# EAGLE design schematic1 (EAGLE 7.1.0)
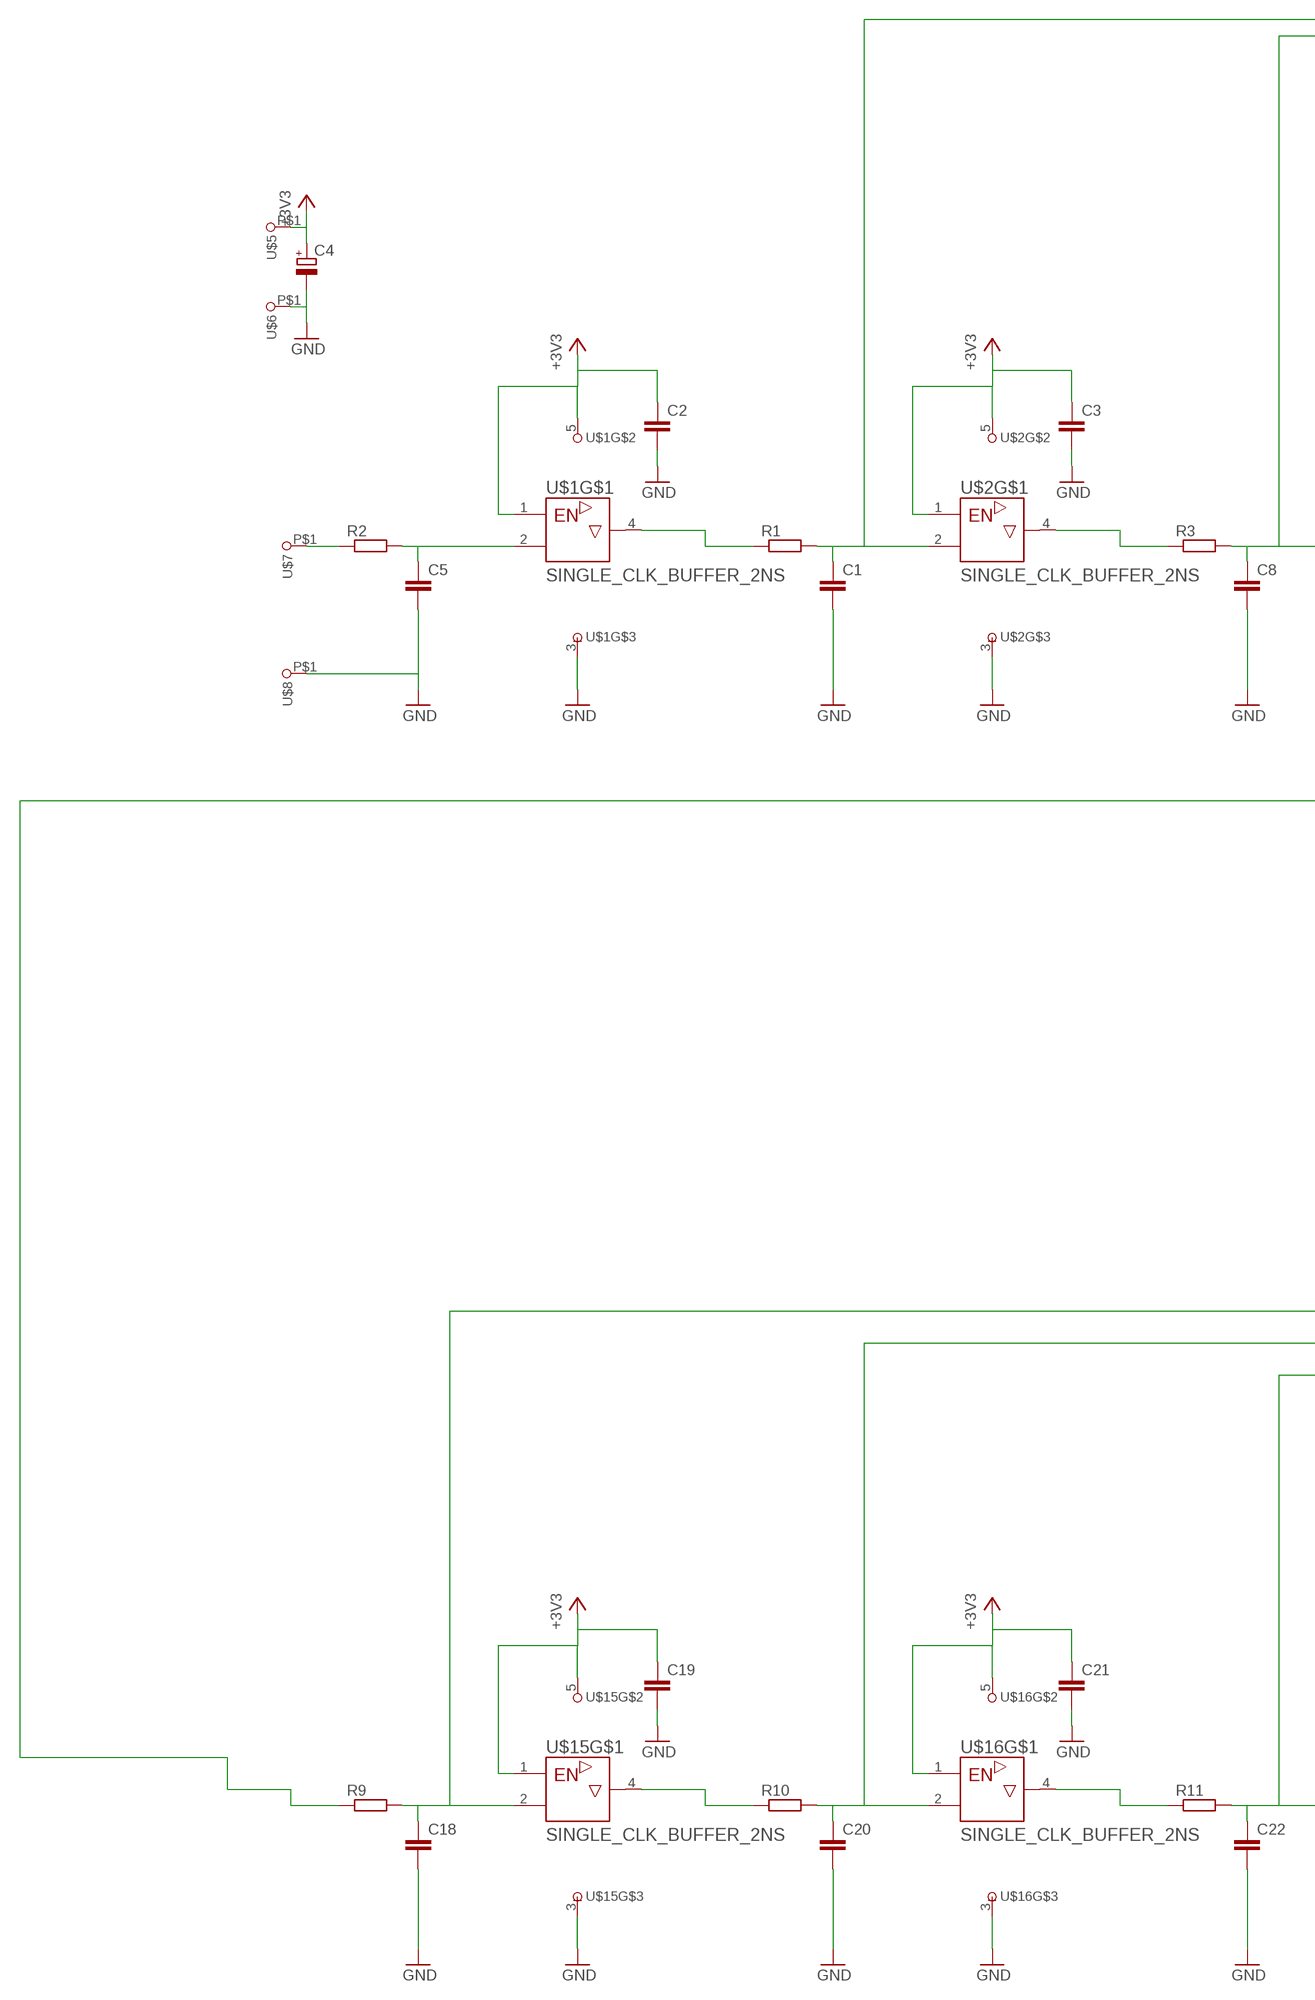
[diagram p0: schematic, sheet 1, part 1 of 2]
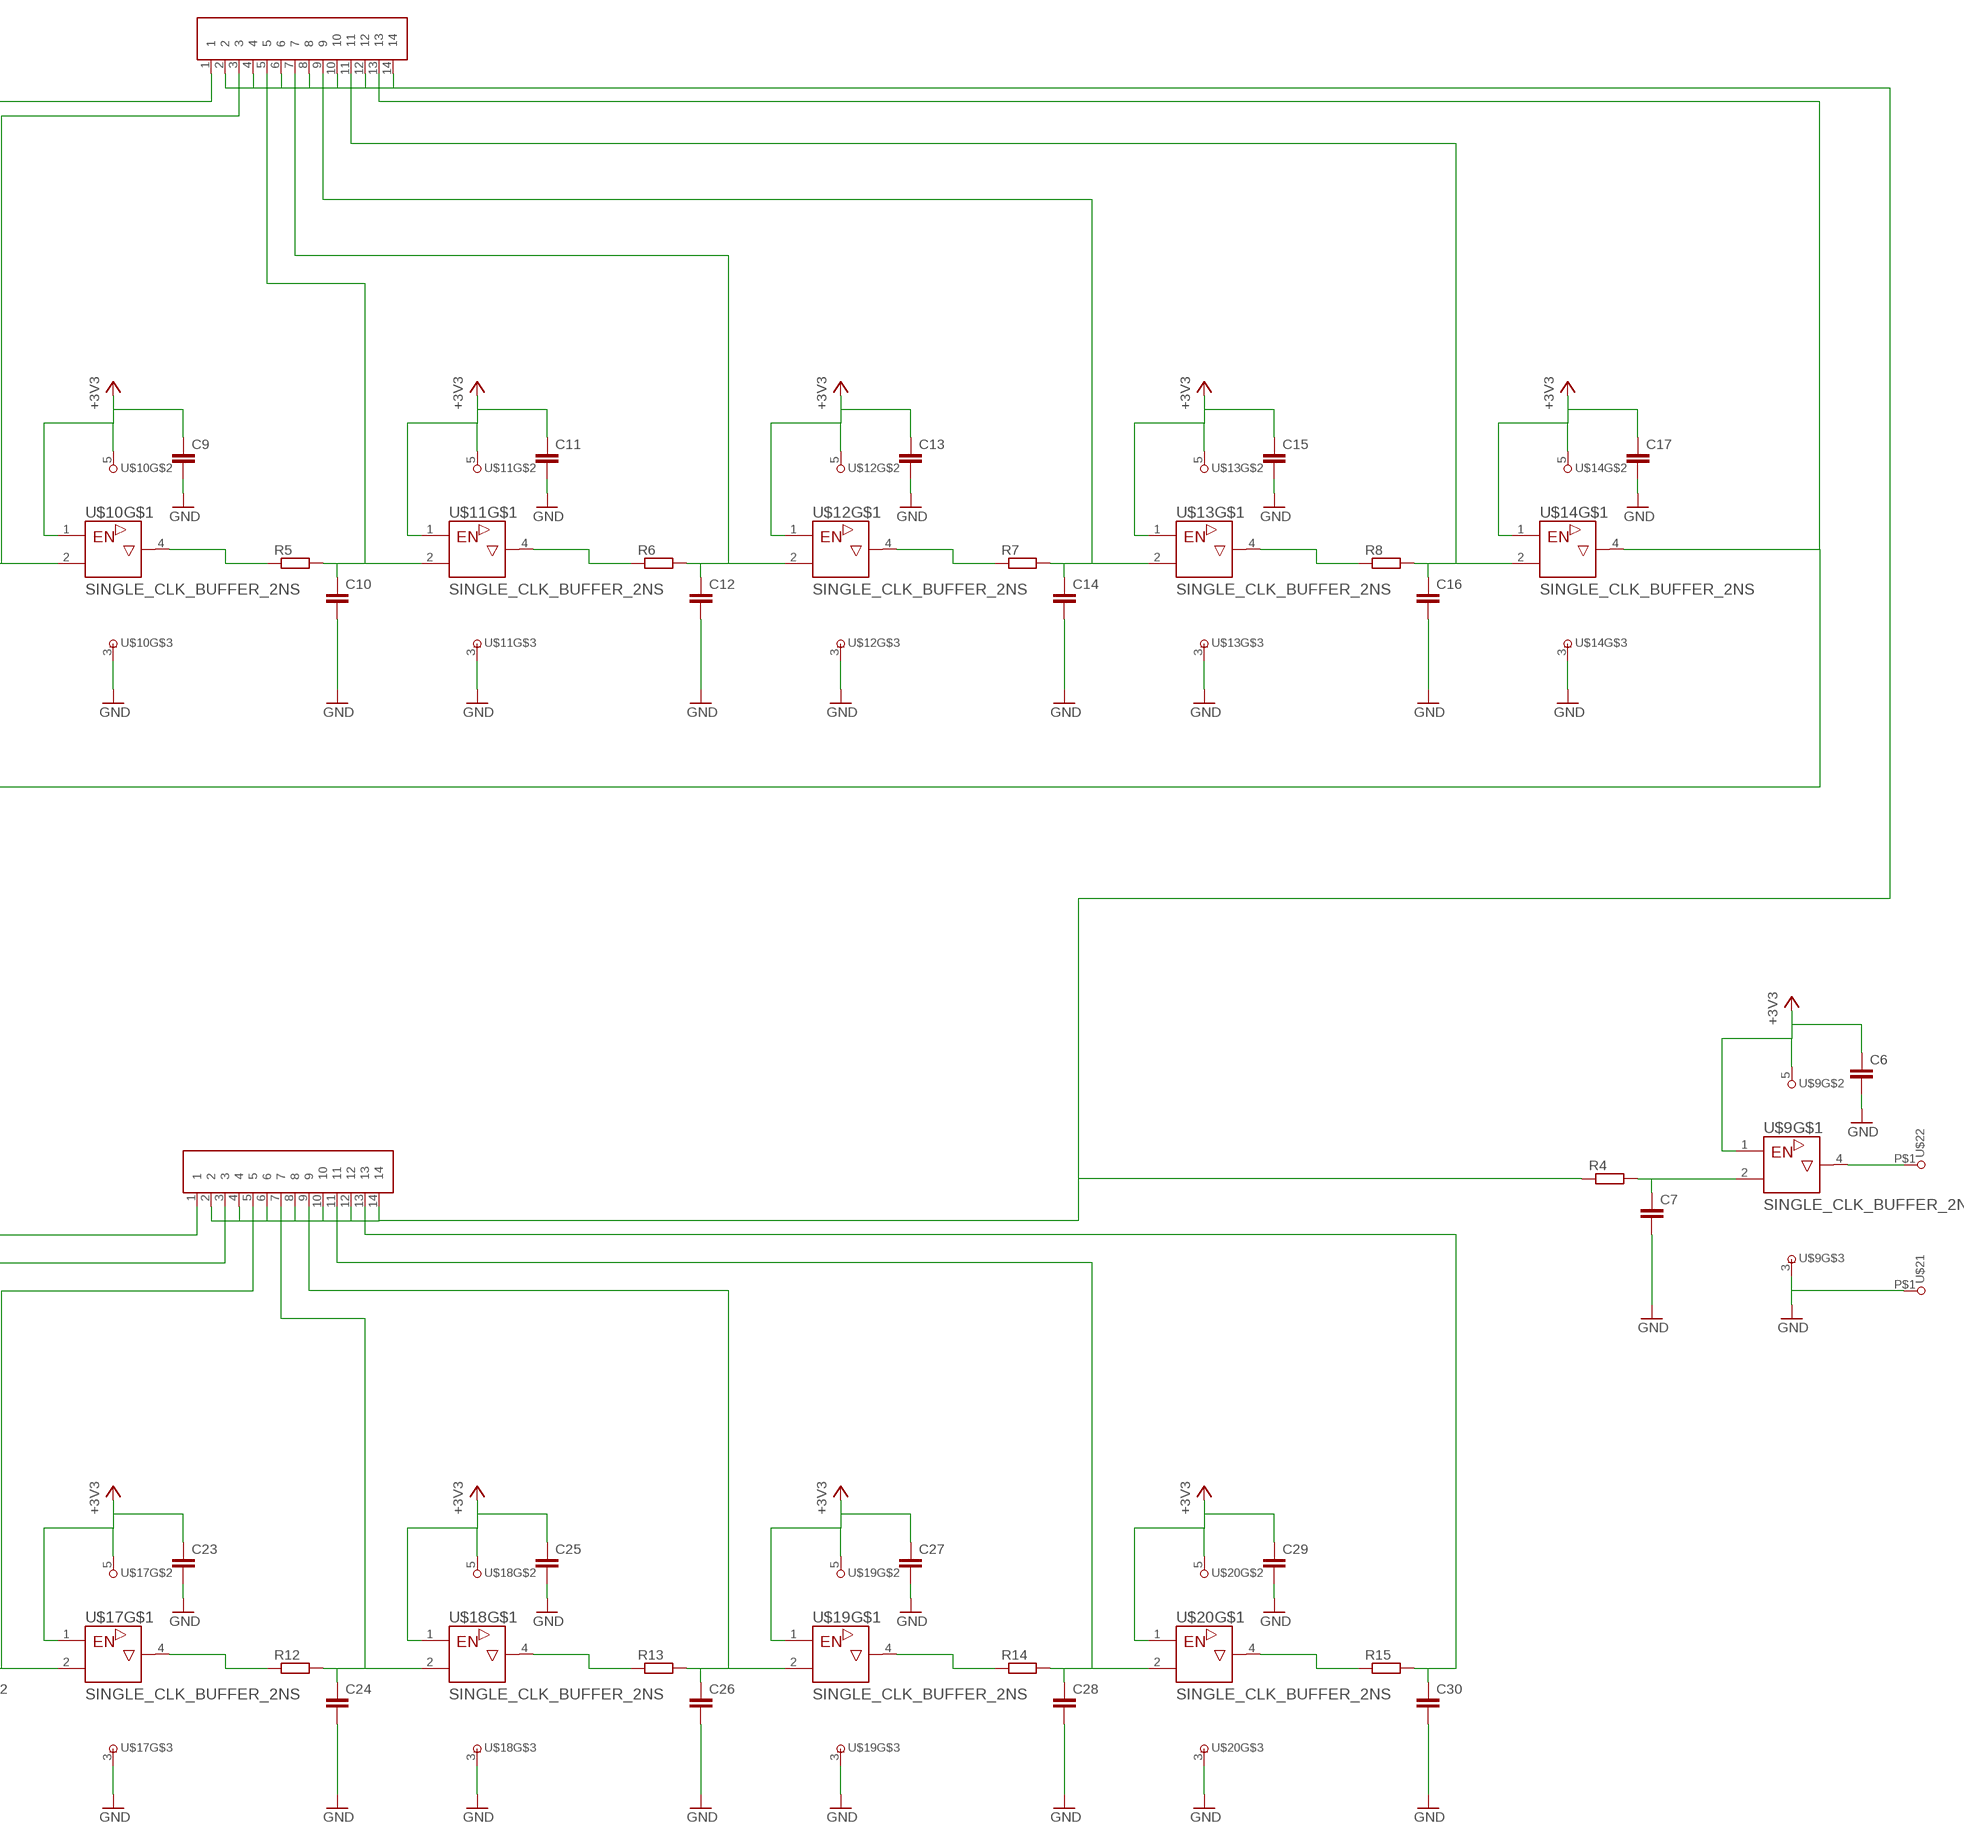
[diagram p1: schematic, sheet 1, part 2 of 2]

## Parts
C1  C-EUC0603  [C0603]
C2  C-EUC0805  [C0805]
C3  C-EUC0805  [C0805]
C4  CPOL-EUSMCD  [SMC_D]
C5  C-EUC0603  [C0603]
C6  C-EUC0805  [C0805]
C7  C-EUC0603  [C0603]
C8  C-EUC0603  [C0603]
C9  C-EUC0805  [C0805]
C10  C-EUC0603  [C0603]
C11  C-EUC0805  [C0805]
C12  C-EUC0603  [C0603]
C13  C-EUC0805  [C0805]
C14  C-EUC0603  [C0603]
C15  C-EUC0805  [C0805]
C16  C-EUC0603  [C0603]
C17  C-EUC0805  [C0805]
C18  C-EUC0603  [C0603]
C19  C-EUC0805  [C0805]
C20  C-EUC0603  [C0603]
C21  C-EUC0805  [C0805]
C22  C-EUC0603  [C0603]
C23  C-EUC0805  [C0805]
C24  C-EUC0603  [C0603]
C25  C-EUC0805  [C0805]
C26  C-EUC0603  [C0603]
C27  C-EUC0805  [C0805]
C28  C-EUC0603  [C0603]
C29  C-EUC0805  [C0805]
C30  C-EUC0603  [C0603]
R1  R-EU_R0603  [R0603]
R2  R-EU_R0603  [R0603]
R3  R-EU_R0603  [R0603]
R4  R-EU_R0603  [R0603]
R5  R-EU_R0603  [R0603]
R6  R-EU_R0603  [R0603]
R7  R-EU_R0603  [R0603]
R8  R-EU_R0603  [R0603]
R9  R-EU_R0603  [R0603]
R10  R-EU_R0603  [R0603]
R11  R-EU_R0603  [R0603]
R12  R-EU_R0603  [R0603]
R13  R-EU_R0603  [R0603]
R14  R-EU_R0603  [R0603]
R15  R-EU_R0603  [R0603]
U$1  SINGLE_CLK_BUFFER_2NS  [DCK]
U$2  SINGLE_CLK_BUFFER_2NS  [DCK]
U$3  2X7SMD_HEADER  [2X14SMDPADS]
U$4  2X7SMD_HEADER  [2X14SMDPADS]
U$5  BIGGOPAD  [BIGGOPAD]
U$6  BIGGOPAD  [BIGGOPAD]
U$7  BIGGOPAD  [BIGGOPAD]
U$8  BIGGOPAD  [BIGGOPAD]
U$9  SINGLE_CLK_BUFFER_2NS  [DCK]
U$10  SINGLE_CLK_BUFFER_2NS  [DCK]
U$11  SINGLE_CLK_BUFFER_2NS  [DCK]
U$12  SINGLE_CLK_BUFFER_2NS  [DCK]
U$13  SINGLE_CLK_BUFFER_2NS  [DCK]
U$14  SINGLE_CLK_BUFFER_2NS  [DCK]
U$15  SINGLE_CLK_BUFFER_2NS  [DCK]
U$16  SINGLE_CLK_BUFFER_2NS  [DCK]
U$17  SINGLE_CLK_BUFFER_2NS  [DCK]
U$18  SINGLE_CLK_BUFFER_2NS  [DCK]
U$19  SINGLE_CLK_BUFFER_2NS  [DCK]
U$20  SINGLE_CLK_BUFFER_2NS  [DCK]
U$21  BIGGOPAD  [BIGGOPAD]
U$22  BIGGOPAD  [BIGGOPAD]

## Nets
+3V3: C2.1 C3.1 C4.+ C6.1 C9.1 C11.1 C13.1 C15.1 C17.1 C19.1 C21.1 C23.1 C25.1 C27.1 C29.1 U$1.1(G) U$1.5(+UB) U$2.1(G) U$2.5(+UB) U$5.P$1(+UB) U$9.1(G) U$9.5(+UB) U$10.1(G) U$10.5(+UB) U$11.1(G) U$11.5(+UB) U$12.1(G) U$12.5(+UB) U$13.1(G) U$13.5(+UB) U$14.1(G) U$14.5(+UB) U$15.1(G) U$15.5(+UB) U$16.1(G) U$16.5(+UB) U$17.1(G) U$17.5(+UB) U$18.1(G) U$18.5(+UB) U$19.1(G) U$19.5(+UB) U$20.1(G) U$20.5(+UB)
GND [Ground]: C1.2 C2.2 C3.2 C4.- C5.2 C6.2 C7.2 C8.2 C9.2 C10.2 C11.2 C12.2 C13.2 C14.2 C15.2 C16.2 C17.2 C18.2 C19.2 C20.2 C21.2 C22.2 C23.2 C24.2 C25.2 C26.2 C27.2 C28.2 C29.2 C30.2 U$1.3(-UB) U$2.3(-UB) U$6.P$1(+UB) U$8.P$1(+UB) U$9.3(-UB) U$10.3(-UB) U$11.3(-UB) U$12.3(-UB) U$13.3(-UB) U$14.3(-UB) U$15.3(-UB) U$16.3(-UB) U$17.3(-UB) U$18.3(-UB) U$19.3(-UB) U$20.3(-UB) U$21.P$1(+UB)
N$1: C5.1 R2.2 U$1.2(A)
N$2: R2.1 U$7.P$1(+UB)
N$3: C1.1 R1.2 U$2.2(A) U$3.1
N$4: R1.1 U$1.4(Y)
N$5: C7.1 R4.2 U$9.2(A)
N$6: R3.1 U$2.4(Y)
N$7: C8.1 R3.2 U$3.3 U$10.2(A)
N$9: C10.1 R5.2 U$3.5 U$11.2(A)
N$10: R5.1 U$10.4(Y)
N$11: C12.1 R6.2 U$3.7 U$12.2(A)
N$12: R6.1 U$11.4(Y)
N$13: C14.1 R7.2 U$3.9 U$13.2(A)
N$14: R7.1 U$12.4(Y)
N$15: C16.1 R8.2 U$3.11 U$14.2(A)
N$16: R8.1 U$13.4(Y)
N$17: C18.1 R9.2 U$4.1 U$15.2(A)
N$18: R9.1 U$3.13 U$14.4(Y)
N$19: C20.1 R10.2 U$4.3 U$16.2(A)
N$20: R10.1 U$15.4(Y)
N$21: C22.1 R11.2 U$4.5 U$17.2(A)
N$22: R11.1 U$16.4(Y)
N$23: C24.1 R12.2 U$4.7 U$18.2(A)
N$24: R12.1 U$17.4(Y)
N$25: C26.1 R13.2 U$4.9 U$19.2(A)
N$26: R13.1 U$18.4(Y)
N$27: C28.1 R14.2 U$4.11 U$20.2(A)
N$28: R14.1 U$19.4(Y)
N$29: C30.1 R15.2 U$4.13
N$30: R15.1 U$20.4(Y)
N$31: U$9.4(Y) U$22.P$1(+UB)
OUTPUT [otp]: R4.1 U$3.2 U$3.4 U$3.6 U$3.8 U$3.10 U$3.12 U$3.14 U$4.2 U$4.4 U$4.6 U$4.8 U$4.10 U$4.12 U$4.14

## Library data of the parts
C1-C3 C5-C30 = rcl:C-EU: CAPACITOR, European symbol
C4 = rcl:CPOL-EU: POLARIZED CAPACITOR, European symbol
R1-R15 = rcl:R-EU_: RESISTOR, European symbol
U$1 U$2 U$9-U$20 = misc:SINGLE_CLK_BUFFER_2NS
U$3 U$4 = synth_design:2X7SMD_HEADER
U$5-U$8 U$21 U$22 = misc:BIGGOPAD

## Net classes
1 Ground: clearance 0.305 mm
2 otp: clearance 0.305 mm

## Board
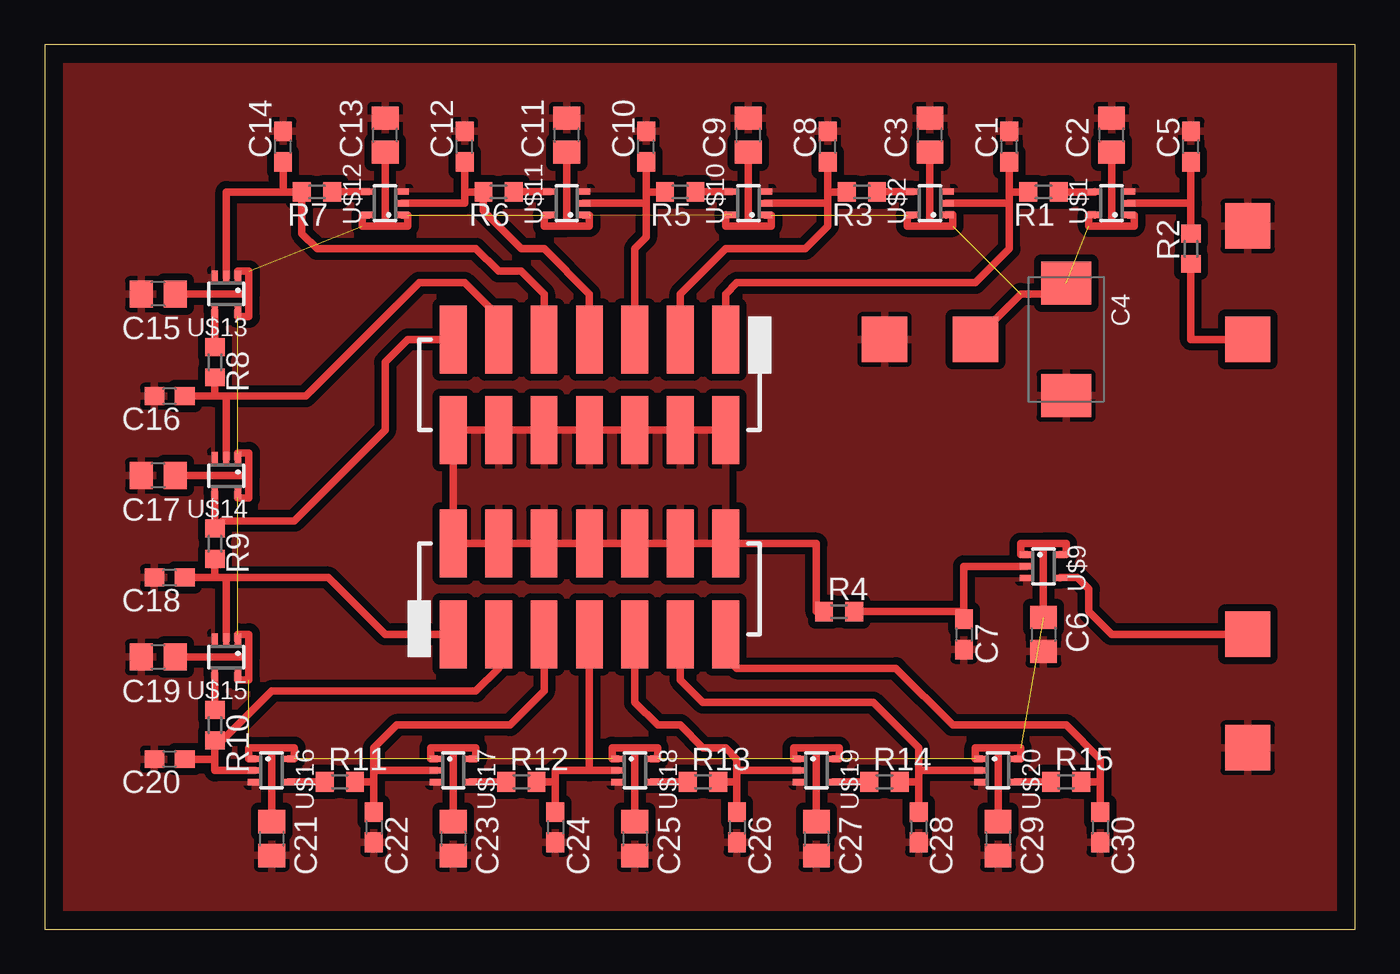
[diagram p2: board, top side]

Size 73.33 x 49.52 mm. Coordinates in mm from the lower left corner, seen from the top.
Outline: 0,0 73.33,0 73.33,49.52 0,49.52 0,0
Copper layers (1*16): Top 0.035mm / dielectric 1.5mm / Bottom 0.035mm
Design rules "default *": minimum track width 10mil, minimum drill 24mil, track to track 16mil, track to pad 12mil, pad to pad 16mil, via to via 16mil, smd to smd 8mil, copper to edge 40mil, drill to drill 8mil, minimum pad ring 10mil, minimum via ring 8mil, stop-mask expansion 4mil, vias tented up to drill 0mil, thermal gap 10mil

### Footprints (pad centres in the part's own frame; a part is rotated, then mirrored left to right if it is on the bottom)
C0603 = smd 1.1 x 1: 1 -0.85,0; 2 0.85,0
C0805 = smd 1.3 x 1.5: 1 -0.95,0; 2 0.95,0
SMC_D = smd 2.4 x 2.8: + -3.15,0; - 3.15,0
R0603 = smd 1 x 1.1: 1 -0.85,0; 2 0.85,0
DCK = smd 0.35 x 0.8: 1 -0.65,-0.925; 2 0,-0.925; 3 0.65,-0.925; 4 0.65,0.925; 5 -0.65,0.925
2X14SMDPADS = smd 3.81 x 1.499: 1 -2.54,7.62; 2 2.54,7.62; 3 -2.54,5.08; 4 2.54,5.08; 5 -2.54,2.54; 6 2.54,2.54; 7 -2.54,0; 8 2.54,0; 9 -2.54,-2.54; 10 2.54,-2.54; 11 -2.54,-5.08; 12 2.54,-5.08; 13 -2.54,-7.62; 14 2.54,-7.62
BIGGOPAD = smd 2.54 x 2.54: P$1 0,0

### Placement (x,y rotation side)
C1  53.98,43.81 90 top
C2  59.69,44.45 90 top
C3  49.53,44.45 90 top
C4  57.15,33.02 270 top
C5  64.14,43.81 90 top
C6  55.88,16.51 270 top
C7  51.44,16.51 270 top
C8  43.81,43.81 90 top
C9  39.37,44.45 90 top
C10  33.66,43.81 90 top
C11  29.21,44.45 90 top
C12  23.5,43.81 90 top
C13  19.05,44.45 90 top
C14  13.34,43.81 90 top
C15  6.35,35.56 180 top
C16  6.99,29.84 180 top
C17  6.35,25.4 180 top
C18  6.99,19.68 180 top
C19  6.35,15.24 180 top
C20  6.99,9.53 180 top
C21  12.7,5.08 270 top
C22  18.41,5.71 270 top
C23  22.86,5.08 270 top
C24  28.57,5.71 270 top
C25  33.02,5.08 270 top
C26  38.73,5.71 270 top
C27  43.18,5.08 270 top
C28  48.9,5.71 270 top
C29  53.34,5.08 270 top
C30  59.05,5.71 270 top
R1  55.88,41.27 180 top
R2  64.14,38.1 90 top
R3  45.72,41.27 180 top
R4  44.45,17.78 0 top
R5  35.56,41.27 180 top
R6  25.4,41.27 180 top
R7  15.24,41.27 180 top
R8  9.53,31.75 270 top
R9  9.53,21.59 270 top
R10  9.53,11.43 270 top
R11  16.51,8.26 0 top
R12  26.67,8.26 0 top
R13  36.83,8.26 0 top
R14  46.99,8.26 0 top
R15  57.15,8.26 0 top
U$1  59.69,40.64 90 top
U$2  49.53,40.64 90 top
U$3  30.48,30.48 270 top
U$4  30.48,19.05 90 top
U$5  52.07,33.02 180 top
U$6  67.31,39.37 180 top
U$7  67.31,33.02 180 top
U$8  46.99,33.02 180 top
U$9  55.88,20.32 270 top
U$10  39.37,40.64 90 top
U$11  29.21,40.64 90 top
U$12  19.05,40.64 90 top
U$13  10.16,35.56 180 top
U$14  10.16,25.4 180 top
U$15  10.16,15.24 180 top
U$16  12.7,8.89 270 top
U$17  22.86,8.89 270 top
U$18  33.02,8.89 270 top
U$19  43.18,8.89 270 top
U$20  53.34,8.89 270 top
U$21  67.31,10.16 0 top
U$22  67.31,16.51 0 top

### Tracks (layer width: path | path; a pad name or v marks a point on that pad's centre or on a via)
+3V3  (15 unrouted)
  Top 0.406: U$1.1 60.96,39.99 60.96,39.37 59.69,39.37 | 59.69,39.37 58.42,39.37 58.42,40.01 58.77,40.01 U$1.5 | C2.1 59.69,39.37 | U$2.5 48.26,39.99 48.26,39.37 49.53,39.37 | 49.53,39.37 50.8,39.37 50.8,40.01 50.45,40.01 U$2.1 | C3.1 49.53,39.37 | U$10.1 40.64,39.99 40.64,39.37 39.37,39.37 | 38.1,40.01 38.1,39.37 39.37,39.37 | U$11.1 30.48,39.99 30.48,39.37 29.21,39.37 | 29.21,39.37 C11.1 | U$11.5 27.94,39.99 27.94,39.37 29.21,39.37 | U$12.1 20.32,39.99 20.32,39.37 19.05,39.37 | 19.05,39.37 C13.1 | U$12.5 17.78,39.99 17.78,39.37 19.05,39.37 | U$13.1 10.81,36.83 11.43,36.83 11.43,35.56 | 11.43,35.56 C15.1 | U$13.5 10.81,34.29 11.43,34.29 11.43,35.56 | U$14.1 10.81,26.67 11.43,26.67 11.43,25.4 | 11.43,25.4 C17.1 | U$14.5 10.81,24.13 11.43,24.13 11.43,25.4 | C9.1 39.37,39.37 | U$15.5 10.81,13.97 11.43,13.97 11.43,15.24 | 11.43,15.24 C19.1 | U$15.1 10.81,16.51 11.43,16.51 11.43,15.24 | U$16.1 11.43,9.54 11.43,10.16 12.7,10.16 | 12.7,10.16 C21.1 | U$16.5 13.97,9.54 13.97,10.16 12.7,10.16 | U$17.1 21.59,9.54 21.59,10.16 22.86,10.16 | 22.86,10.16 C23.1 | U$17.5 24.13,9.54 24.13,10.16 22.86,10.16 | U$18.1 31.75,9.54 31.75,10.16 33.02,10.16 | 33.02,10.16 C25.1 | U$18.5 34.29,9.54 34.29,10.16 33.02,10.16 | U$19.1 41.91,9.54 41.91,10.16 43.18,10.16 | 43.18,10.16 C27.1 | U$19.5 44.45,9.54 44.45,10.16 43.18,10.16 | U$20.1 52.07,9.54 52.07,10.16 53.34,10.16 | 53.34,10.16 C29.1 | U$20.5 54.61,9.54 54.61,10.16 53.34,10.16 | U$9.5 57.15,20.97 57.15,21.59 55.88,21.59 | 55.88,21.59 C6.1 | U$9.1 54.61,20.97 54.61,21.59 55.88,21.59 | U$5.P$1 54.61,35.56 56.54,35.56 C4.+
GND
  pour Top (rank 4): 0,49.53 73.66,49.53 73.66,0 0,0
N$1
  Top 0.406: R2.2 64.14,40.64 | 64.14,40.64 C5.1 | U$1.2 64.14,40.64
N$2
  Top 0.406: U$7.P$1 64.14,33.02 R2.1
N$3
  Top 0.406: R1.2 53.98,41.27 | 53.98,41.27 C1.1 | U$2.2 53.98,40.64 | 53.98,40.64 53.98,41.27 | U$3.1 38.1,35.56 38.73,36.2 52.07,36.2 53.98,38.1 53.98,40.64
N$4
  Top 0.406: R1.1 58.77,41.27 U$1.4
N$5
  Top 0.406: U$9.2 51.44,20.32 C7.1 51.44,17.78 R4.2
N$6
  Top 0.406: U$2.4 46.57,41.29 R3.1
N$7
  Top 0.406: R3.2 43.81,41.27 | 43.81,41.27 C8.1 | U$10.2 43.81,40.64 | 43.81,40.64 43.81,41.27 | U$3.3 35.56,35.56 38.1,38.1 42.55,38.1 43.81,39.37 43.81,40.64
N$9
  Top 0.406: R5.2 33.66,41.27 | 33.66,41.27 C10.1 | U$11.2 33.66,40.64 | 33.66,40.64 33.66,41.27 | 33.66,40.64 33.66,38.73 33.02,38.1 U$3.5
N$10
  Top 0.406: U$10.4 36.41,41.29 R5.1
N$11
  Top 0.406: 23.5,41.27 R6.2 24.55,40.22 26.67,38.1 27.94,38.1 30.48,35.56 U$3.7 | 23.5,41.27 C12.1 | U$12.2 23.5,40.64 23.5,41.27
N$12
  Top 0.406: U$11.4 26.25,41.29 R6.1
N$13
  Top 0.406: 13.34,41.27 R7.2 14.39,38.95 15.24,38.1 24.13,38.1 25.4,36.83 26.67,36.83 27.94,35.56 U$3.9 | 13.34,41.27 C14.1 | U$13.2 10.16,41.27 13.34,41.27
N$14
  Top 0.406: U$12.4 16.09,41.29 R7.1
N$15
  Top 0.406: R8.2 9.53,29.84 | 9.53,29.84 C16.1 | U$14.2 10.16,29.84 | 10.16,29.84 9.53,29.84 | 10.16,29.84 14.61,29.84 20.95,36.2 23.5,36.2 25.4,34.29 U$3.11
N$16
  Top 0.406: U$13.4 9.51,32.6 R8.1
N$17
  Top 0.406: R9.2 9.53,19.68 | 9.53,19.68 C18.1 | U$15.2 10.16,19.68 | 10.16,19.68 9.53,19.68 | U$4.1 19.05,16.51 15.88,19.68 10.16,19.68
N$18
  Top 0.406: U$14.4 9.51,22.44 R9.1 9.95,22.86 13.97,22.86 19.05,27.94 19.05,31.75 20.32,33.02 U$3.13
N$19
  Top 0.406: 9.53,9.53 R10.2 9.95,10.58 12.7,13.34 24.13,13.34 25.4,14.61 U$4.3 | 9.53,9.53 C20.1 | U$16.2 9.53,8.89 9.53,9.53
N$20
  Top 0.406: U$15.4 9.51,12.28 R10.1
N$21
  Top 0.406: R11.2 18.41,8.26 | 18.41,8.26 C22.1 | U$17.2 18.41,8.89 | 18.41,8.89 18.41,8.26 | U$4.5 27.94,13.34 26.04,11.43 19.68,11.43 18.41,10.16 18.41,8.89
N$22
  Top 0.406: U$16.4 15.66,8.24 R11.1
N$23
  Top 0.406: R12.2 28.57,8.26 | 28.57,8.26 C24.1 | U$18.2 30.48,8.89 | 30.48,8.89 28.57,8.89 28.57,8.26 | U$4.7 30.48,8.89
N$24
  Top 0.406: U$17.4 25.82,8.24 R12.1
N$25
  Top 0.406: R13.2 38.73,8.26 | 38.73,8.26 C26.1 | U$19.2 38.73,8.89 | 38.73,8.89 38.73,8.26 | U$4.9 33.02,12.7 34.29,11.43 35.56,11.43 36.83,10.16 38.1,10.16 38.73,9.53 38.73,8.89
N$26
  Top 0.406: U$18.4 35.98,8.24 R13.1
N$27
  Top 0.406: R14.2 48.9,8.26 | 48.9,8.26 C28.1 | U$20.2 48.9,8.89 | 48.9,8.89 48.9,8.26 | U$4.11 35.56,13.97 36.83,12.7 46.35,12.7 48.9,10.16 48.9,8.89
N$28
  Top 0.406: U$19.4 46.14,8.24 R14.1
N$29
  Top 0.406: R15.2 59.05,8.26 | 59.05,8.26 C30.1 | U$4.13 38.1,15.24 38.73,14.61 47.62,14.61 50.8,11.43 57.15,11.43 59.05,9.53 59.05,8.26
N$30
  Top 0.406: U$20.4 56.3,8.24 R15.1
N$31
  Top 0.406: U$22.P$1 59.69,16.51 58.42,17.78 58.42,19.05 57.78,19.68 56.82,19.68 U$9.4
OUTPUT
  Top 0.406: R4.1 43.18,17.78 43.18,21.59 U$4.14 U$4.12 U$4.10 U$4.8 U$4.6 U$4.4 U$4.2 U$3.14 U$3.12 U$3.10 U$3.8 U$3.6 U$3.4 U$3.2
  pour Top (isolate 0.61, rank 2): 22.86,27.94 38.1,27.94 38.1,21.59 22.86,21.59